# Altium schematic sheet zigbee_esp_gateway_schematic.SchDoc
size A3
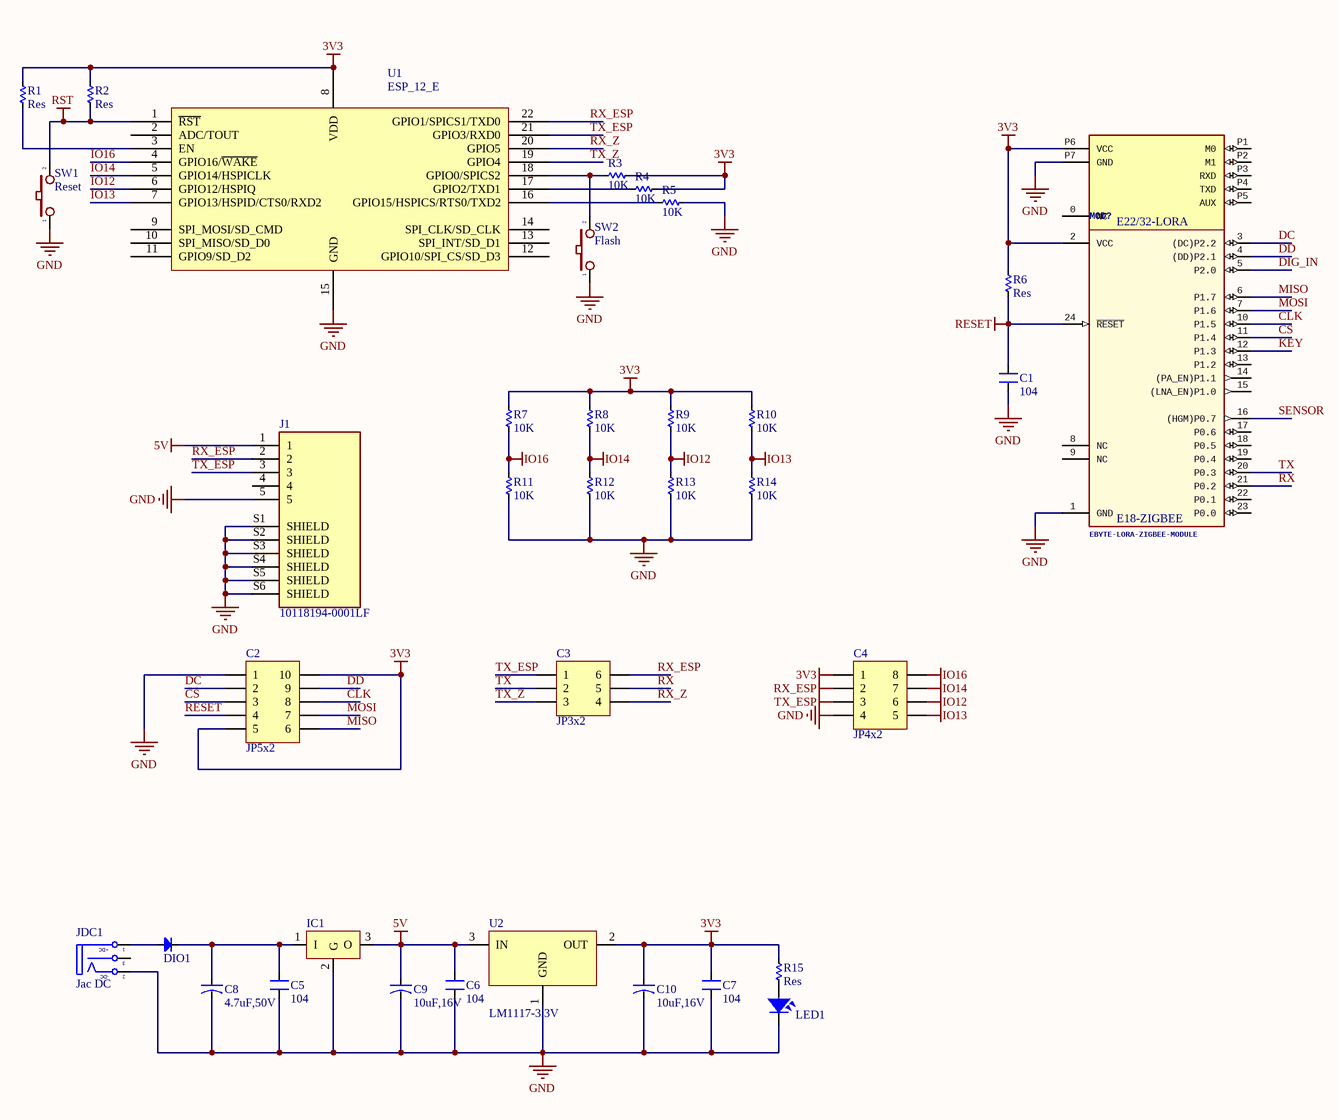
[diagram p0: zigbee_esp_gateway_schematic.SchDoc]

## Parts
C1  104  [SM-CAP-0805]
C2  JP5x2  [JP5-D2T]
C3  JP3x2  [JP3-D2T]
C4  JP4x2  [JP4-D2T]
C5  104  [SM-CAP-0805]
C6  104  [SM-CAP-0805]
C7  104  [SM-CAP-0805]
C8  4.7uF,50V  [CAP-ALU-SMD-6.3x7.7x2.2]
C9  10uF,16V  [CAP-ALU-SMD-5x5.5x1.4]
C10  10uF,16V  [CAP-ALU-SMD-5x5.5x1.4]
DIO1  Diode SMD  [DIO-SMD-106]  (value not drawn)
IC1  LM78xx  [TO252-123]  (value not drawn)
J1  10118194-0001LF  [AMPHENOL_10118194-0001LF]
JDC1  Jac DC  [DC3]
LED1  LED  [LED-0805-Red]  (value not drawn)
MOD?  EBYTE-LORA-ZIGBEE-MODULE  [EBYTE-LORA-ZIGBEE-MODULE]
R1  Res  [RES-SMD-0805]
R2  Res  [RES-SMD-0805]
R3  10K  [RES-SMD-0805]
R4  10K  [RES-SMD-0805]
R5  10K  [RES-SMD-0805]
R6  Res  [RES-SMD-0805]
R7  10K  [RES-SMD-0805]
R8  10K  [RES-SMD-0805]
R9  10K  [RES-SMD-0805]
R10  10K  [RES-SMD-0805]
R11  10K  [RES-SMD-0805]
R12  10K  [RES-SMD-0805]
R13  10K  [RES-SMD-0805]
R14  10K  [RES-SMD-0805]
R15  Res  [RES-SMD-0805]
SW1  Reset  [SW1-SMD]
SW2  Flash  [SW-DIP1-1]
U1  ESP_12_E  [ESP_12_E]
U2  LM1117-3.3V  [SOT223]

## Nets
3V3: C2.5 C2.10 C4.1 C7.2 C10.1 MOD?.2(VCC) MOD?.P6(VCC) R1.2 R2.2 R3.1 R4.1 R6.1 R7.1 R8.1 R9.1 R10.1 R15.1 U1.8(VDD) U2.2(OUT)
5V: C6.2 C9.1 IC1.3(O) J1.1 U2.3(IN)
GND: C1.1 C2.1 C4.4 C5.1 C6.1 C7.1 C8.2 C9.2 C10.2 IC1.2(G) J1.5 J1.S1(SHIELD) J1.S2(SHIELD) J1.S3(SHIELD) J1.S4(SHIELD) J1.S5(SHIELD) J1.S6(SHIELD) JDC1.2(TN) LED1.2 MOD?.1(GND) MOD?.P7(GND) R5.1 R11.2 R12.2 R13.2 R14.2 SW1.1 SW2.1 U1.15(GND) U2.1(GND)
IO12: C4.6 R9.2 R13.1 U1.6(GPIO12/HSPIQ)
IO13: C4.5 R10.2 R14.1 U1.7(GPIO13/HSPID/CTS0/RXD2)
IO14: C4.7 R8.2 R12.1 U1.5(GPIO14/HSPICLK)
IO16: C4.8 R7.2 R11.1 U1.4(GPIO16/~{WAKE})
RESET: C1.2 C2.4 MOD?.24(~{RESET}) R6.2
RST: R2.1 SW1.2 U1.1(~{RST})
RX_ESP: C3.6 C4.2 J1.2 U1.22(GPIO1/SPICS1/TXD0)
TX_ESP: C3.1 C4.3 J1.3 U1.21(GPIO3/RXD0)
CLK: C2.8 MOD?.10(P1.5)
CS: C2.3 MOD?.11(P1.4)
DC: C2.2 MOD?.3((DC)P2.2)
DD: C2.9 MOD?.4((DD)P2.1)
DIG_IN: MOD?.5(P2.0)
KEY: MOD?.12(P1.3)
MISO: C2.6 MOD?.6(P1.7)
MOSI: C2.7 MOD?.7(P1.6)
RX: C3.5 MOD?.21(P0.2)
RX_Z: C3.4 U1.20(GPIO5)
SENSOR: MOD?.16((HGM)P0.7)
TX: C3.2 MOD?.20(P0.3)
TX_Z: C3.3 U1.19(GPIO4)
NetC5_2: C5.2 C8.1 DIO1.2(K) IC1.1(I)
NetDIO1_1: DIO1.1(A) JDC1.1(T)
NetLED1_1: LED1.1 R15.2
NetR1_1: R1.1 U1.3(EN)
NetR3_2: R3.2 SW2.2 U1.18(GPIO0/SPICS2)
NetR4_2: R4.2 U1.17(GPIO2/TXD1)
NetR5_2: R5.2 U1.16(GPIO15/HSPICS/RTS0/TXD2)

Not connected (* = marked no-connect by the designer): J1 4; JDC1 3(S); MOD? 0(NC) 8(NC) 9(NC) 13(P1.2) 14((PA_EN)P1.1) 15((LNA_EN)P1.0) 17(P0.6) 18(P0.5) 19(P0.4) 22(P0.1) 23(P0.0) P1(M0) P2(M1) P3(RXD) P4(TXD) P5(AUX); U1 2(ADC/TOUT) 9(SPI_MOSI/SD_CMD) 10(SPI_MISO/SD_D0) 11(GPIO9/SD_D2) 12(GPIO10/SPI_CS/SD_D3) 13(SPI_INT/SD_D1) 14(SPI_CLK/SD_CLK)

## Notes on the sheet
- (in symbol DCIN) +DC; -DC
- (in symbol EBYTE-LORA-ZIGBEE-MODULE) E22/32-LORA; E18-ZIGBEE

## Library data of the parts
C1 C5-C7 = CN: Value: 0,1uF/300V; Designed by: VanDungEvn
C2 = JP5x2: WR-PHD 2.54 mm Dual Socket Header; Manufacturer: W¨¹rth Elektronik eiSos GmbH; partNo: 61301021821; ComponentLink1 Description: Manufacturer; ComponentLink2 Description: Datasheet; NoPins: 10; Created Date: 29 March 2013; ComponentLink1URL: http://www.we-online.com; ComponentLink2URL: http://katalog.we-online.de/em/datasheet/6130xx21821.pdf; Created by: Karrer Zheng
C3 = JP3x2: WR-PHD 2.54 mm Dual Socket Header; Manufacturer: W¨¹rth Elektronik eiSos GmbH; partNo: 61300621821; ComponentLink1 Description: Manufacturer; ComponentLink2 Description: Datasheet; NoPins: 06; Created Date: 29 March 2013; ComponentLink1URL: http://www.we-online.com; ComponentLink2URL: http://katalog.we-online.de/em/datasheet/6130xx21821.pdf; Created by: Karrer Zheng
C4 = JP4x2: WR-PHD 2.54 mm Dual Socket Header; Manufacturer: W¨¹rth Elektronik eiSos GmbH; partNo: 61300821821; ComponentLink1 Description: Manufacturer; ComponentLink2 Description: Datasheet; NoPins: 08; Created Date: 29 March 2013; ComponentLink1URL: http://www.we-online.com; ComponentLink2URL: http://katalog.we-online.de/em/datasheet/6130xx21821.pdf; Created by: Karrer Zheng
C8-C10 = CN-ALU-SMD: Polarized Capacitor (Axial); Published: 8-Jun-2000; LatestRevisionDate: 17-Jul-2002; LatestRevisionNote: Re-released for DXP Platform.; PackageReference: POLAR0.8; Publisher: Altium Limited
DIO1 = Diode SMD: Default Diode; Code - JEDEC: DO-214-AB; Value: 1N5007; Published: 8-Jun-2000; Revision: July-2002: Re-released for DXP Platform.; Publisher: Altium Limited
IC1 = LM78xx: Positive Voltage Regulator; Note: Tab is connected to pin 3 (GND).; Published: 24-Aug-2001; LatestRevisionDate: 17-Jul-2002; LatestRevisionNote: Re-released for DXP Platform.; DatasheetVersion: Apr-1994; PackageVersion: Jul-1998; PackageReference: ISOWATT220AB; Publisher: Altium Limited; PackageDescription: TO, Thru-Hole, Vertical, Heatsink Mounted; 3 In-Line Leads; Pitch 2.54 mm; Pin sequence 1, 3, 2; ComponentLink1Description: Manufacturer Link; ComponentLink1URL: http://www.st.com/; ComponentLink2Description: Datasheet; ComponentLink2URL: http://www.st.com/stonline/products/literature/ds/2146/l78m05c.pdf
J1 = 10118194-0001LF: USB - micro B USB 2.0 Receptacle Connector 5 Position Surface Mount, Right Angle; Through Hole; MF: Amphenol ICC; Package: None; Price: None; Availability: Unavailable; MP: 10118194-0001LF; SnapEDA_Link: https://www.snapeda.com/parts/10118194-0001LF/Amphenol%20FCI/view-part/1413308/?ref=snap; Value: *
JDC1 = DCIN: Jac DC input; Value: Jac DC
LED1 = LED SMD: Value: LED 3 - 5 ly 2 Colour
MOD? = EBYTE-LORA-ZIGBEE-MODULE: GateName_1: G$1; SymbolName_1: EBYTE-E18-MS1PA1; LibraryName: ok-modules-dev; DeviceSetName: EBYTE-E18-MS1PA1
R1-R15 = Res-SMD: Resistor; Manufacturer: Generic Components; Class: Passive; Published: 08/06/2000; Publisher: Altium Hobart Technology Centre
SW1 SW2 = SW2: Switch button 2 pin; Value: SW chip 2 pin
U1 = ESP_12_E: ESP-12 Wi-Fi Module by AI-Thinker; IC: ESP8266-EX; Vendor: Ai-thinker
U2 = LM1117: 800mA Low-Dropout Linear Regulator; Creator: Nguyen Ba Bien; Website: http://group3i.net